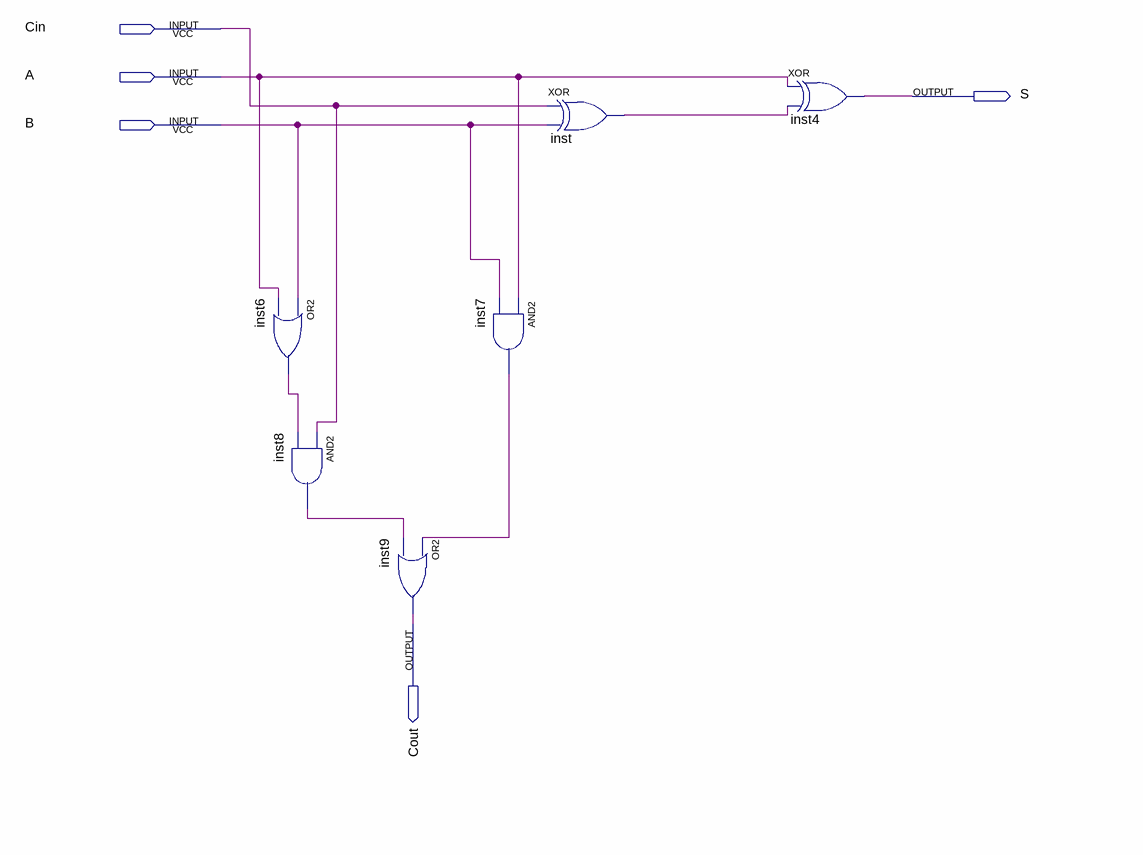
[diagram p0: schematic sheet]
// Quartus schematic FullAdder1BIT.bdf as structural Verilog: 6 symbols, 5 pins
module FullAdder1BIT (
  input  Cin,
  input  A,
  input  B,
  output S,
  output Cout
);

  wire inst6_out, inst7_out, inst8_out, inst_out;

  or inst6 (inst6_out, B, A);
  and inst8 (inst8_out, Cin, inst6_out);
  or inst9 (Cout, inst7_out, inst8_out);
  and inst7 (inst7_out, A, B);
  xor inst (inst_out, Cin, B);
  xor inst4 (S, A, inst_out);
endmodule
